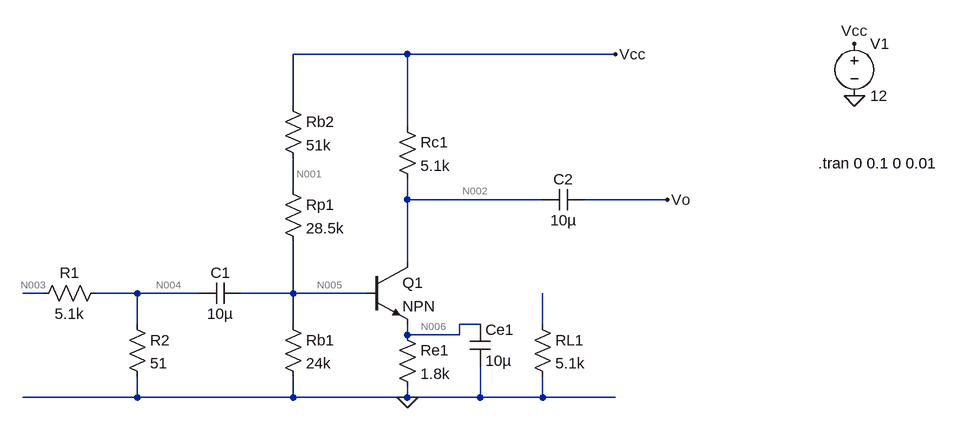
[diagram p0: schematic Experiment2_1_2.asc]
Experiment2_1_2.asc, the LTspice schematic file:
Version 4.1
SHEET 1 972 680
WIRE 32 -160 -144 -160
WIRE 352 -160 32 -160
WIRE -144 -80 -144 -160
WIRE 32 -48 32 -160
WIRE -144 48 -144 0
WIRE 32 64 32 32
WIRE 240 64 32 64
WIRE 432 64 304 64
WIRE 32 160 32 64
WIRE -528 208 -560 208
WIRE -384 208 -448 208
WIRE -288 208 -384 208
WIRE -144 208 -144 128
WIRE -144 208 -224 208
WIRE -32 208 -144 208
WIRE -384 256 -384 208
WIRE -144 256 -144 208
WIRE 144 256 112 256
WIRE 240 256 240 208
WIRE 32 272 32 256
WIRE 112 272 112 256
WIRE 112 272 32 272
WIRE -384 368 -384 336
WIRE -384 368 -560 368
WIRE -144 368 -144 336
WIRE -144 368 -384 368
WIRE 32 368 32 352
WIRE 32 368 -144 368
WIRE 144 368 144 320
WIRE 144 368 32 368
WIRE 240 368 240 336
WIRE 240 368 144 368
WIRE 352 368 240 368
FLAG 32 368 0
FLAG 352 -160 Vcc
FLAG 720 -176 Vcc
FLAG 720 -96 0
FLAG 432 64 Vo
SYMBOL res -432 192 R90
WINDOW 0 0 56 VBottom 2
WINDOW 3 32 56 VTop 2
SYMATTR InstName R1
SYMATTR Value 5.1k
SYMBOL res -400 240 R0
SYMATTR InstName R2
SYMATTR Value 51
SYMBOL res -160 240 R0
SYMATTR InstName Rb1
SYMATTR Value 24k
SYMBOL res -160 32 R0
SYMATTR InstName Rp1
SYMATTR Value 28.5k
SYMBOL res -160 -96 R0
SYMATTR InstName Rb2
SYMATTR Value 51k
SYMBOL npn -32 160 R0
SYMATTR InstName Q1
SYMBOL res 16 256 R0
SYMATTR InstName Re1
SYMATTR Value 1.8k
SYMBOL res 224 240 R0
SYMATTR InstName RL1
SYMATTR Value 5.1k
SYMBOL res 16 -64 R0
SYMATTR InstName Rc1
SYMATTR Value 5.1k
SYMBOL voltage 720 -192 R0
WINDOW 123 0 0 Left 0
WINDOW 39 0 0 Left 0
SYMATTR InstName V1
SYMATTR Value 12
SYMBOL cap -224 192 R90
WINDOW 0 0 32 VBottom 2
WINDOW 3 32 32 VTop 2
SYMATTR InstName C1
SYMATTR Value 10µ
SYMATTR SpiceLine V=6.3 Irms=0 Rser=4 Lser=0 mfg="AVX" pn="TAJA106M006" type="Tantalum"
SYMBOL cap 240 80 R270
WINDOW 0 32 32 VTop 2
WINDOW 3 0 32 VBottom 2
SYMATTR InstName C2
SYMATTR Value 10µ
SYMATTR SpiceLine V=6.3 Irms=0 Rser=4 Lser=0 mfg="AVX" pn="TAJA106M006" type="Tantalum"
SYMBOL cap 128 256 R0
SYMATTR Value 10µ
SYMATTR InstName Ce1
SYMATTR SpiceLine V=6.3 Irms=0 Rser=4 Lser=0 mfg="AVX" pn="TAJA106M006" type="Tantalum"
TEXT 664 8 Left 2 !.tran 0 0.1 0 0.01

The netlist it stands for:
* Experiment2_1_2.asc
R1 N004 N003 5.1k
R2 N004 0 51
Rb1 N005 0 24k
Rp1 N001 N005 28.5k
Rb2 Vcc N001 51k
Q1 N002 N005 N006 0 NPN
Re1 N006 0 1.8k
RL1 N007 0 5.1k
Rc1 Vcc N002 5.1k
V1 Vcc 0 12
C1 N005 N004 10µ V=6.3 Irms=0 Rser=4 Lser=0 mfg="AVX" pn="TAJA106M006" type="Tantalum"
C2 N002 Vo 10µ V=6.3 Irms=0 Rser=4 Lser=0 mfg="AVX" pn="TAJA106M006" type="Tantalum"
Ce1 N006 0 10µ V=6.3 Irms=0 Rser=4 Lser=0 mfg="AVX" pn="TAJA106M006" type="Tantalum"
.model NPN NPN
.model PNP PNP
.lib standard.bjt
.tran 0 0.1 0 0.01
.backanno
.end

* Results of the author's LTspice run, read from the files saved beside the schematic
* Operating Point, zero values left out:
*   V(n001) = 5.968 V
*   V(vcc) = 12 V
*   V(n006) = 1.823 V
*   V(n005) = 2.598 V
*   V(n002) = 6.885 V
*   V(vo) = 6.885 V
*   Ic(Q1) = 1.003 mA
*   Ib(Q1) = 10.03 µA
*   Ie(Q1) = -1.013 mA
*   I(Rb1) = 108.2 µA
*   I(Rb2) = 118.3 µA
*   I(Rp1) = 118.3 µA
*   I(Re1) = 1.013 mA
*   I(V1) = -1.121 mA
*   I(Rc1) = 1.003 mA
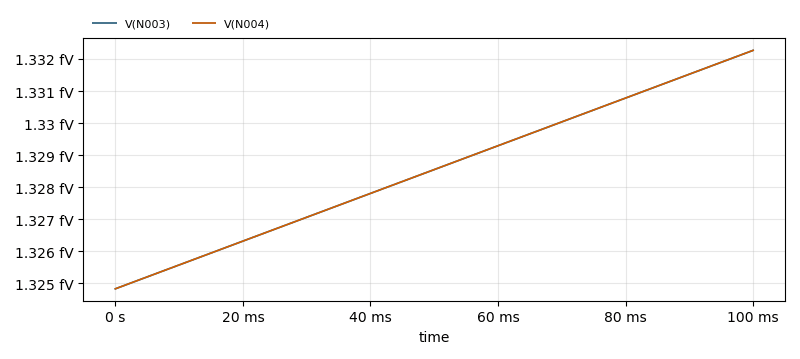
[diagram p1: Transient Analysis of Experiment2_1_2.asc, plotted from the saved traces]
* Transient Analysis, 1 run:
*   V(N003): min 1.325 fV, max 1.332 fV, average 1.329 fV, rms 1.329 fV, last 1.332 fV
*   V(N004): min 1.325 fV, max 1.332 fV, average 1.329 fV, rms 1.329 fV, last 1.332 fV